# Altium schematic sheet Control circuit.SchDoc (part 2 of 4)
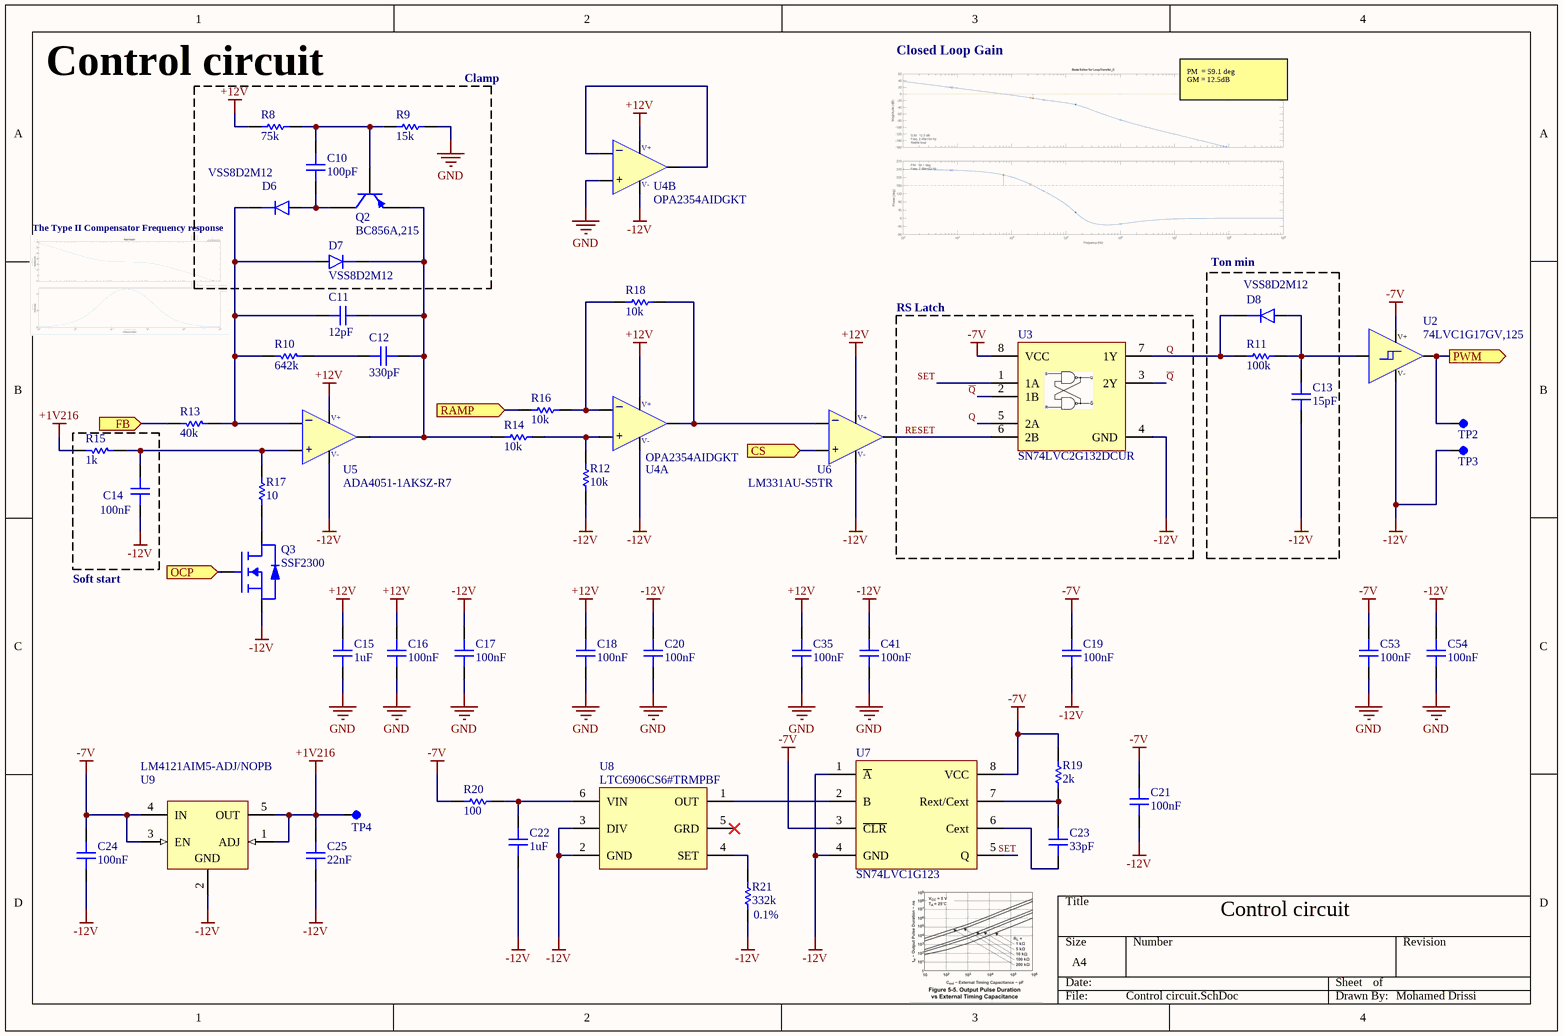
[diagram p1: Control circuit.SchDoc]
## Library data of the parts
C10 = Murata GCM1885C2A101JA16D: 100V 100pF C0G ±5% 0603 Multilayer Ceramic Capacitors MLCC - SMD/SMT ROHS; Manufacturer: Murata; Manufacturer Lifecycle Status: IN PRODUCTION; Temperature Coefficient: 30ppm/°C; Supplier: RS; Supplier Part Number: 8151323P; Manufacturer Part Number: GCM1885C2A101JA16D; RoHS: Compliant; Category: Ceramic Capacitors; Stock: 11200; Pricing: 1000=0,018, 2000=0,017, 5000=0,016, 10000=0,014 (EUR); Case/Package: 0603; Case Code (Imperial): 0603; Case Code (Metric): 1608; Depth: 800µm; Dielectric: C0G; Dielectric Material: Ceramic; Height: 800µm; Lead Free: Lead Free; Length: 1.6mm; Lifecycle Status: Production; Material: Ceramic; Max Operating Temperature: 125°C; Min Operating Temperature: -55°C; Mounting Technology: Surface Mount; Number of Terminals: 2; Radiation Hardening: No; Ratings: AEC-Q200; REACH SVHC: Yes; Schedule B: 8532240020, 8532240020|8532240020, 8532240020|8532240020|8532240020, 8532240020|8532240020|8532240020|8532240020; Termination: SMD/SMT; Tolerance: 5%; Voltage: 100V; Voltage Rating: 100V; Voltage Rating (DC): 100V; Width: 800µm; ComponentLink1URL: https://datasheet.octopart.com:443/GCM1885C2A101JA16D-Murata-datasheet-149522598.pdf?src-supplier=Farnell; ComponentLink1Description: https://datasheet.octopart.com:443/GCM1885C2A101JA16D-Murata-datasheet-149522598.pdf?src-supplier=Farnell; ComponentLink2URL: https://datasheet.octopart.com:443/GCM1885C2A101JA16D-Murata-datasheet-104277829.pdf?src-supplier=Newark; ComponentLink2Description: https://datasheet.octopart.com:443/GCM1885C2A101JA16D-Murata-datasheet-104277829.pdf?src-supplier=Newark; ComponentLink3URL: https://datasheet.octopart.com:443/GCM1885C2A101JA16D-Murata-datasheet-141266551.pdf?src-supplier=Geoflip; ComponentLink3Description: https://datasheet.octopart.com:443/GCM1885C2A101JA16D-Murata-datasheet-141266551.pdf?src-supplier=Geoflip; ComponentLink4URL: https://datasheet.octopart.com:443/GCM1885C2A101JA16D-Murata-datasheet-14404397.pdf?src-supplier=Future+Electronics; ComponentLink4Description: https://datasheet.octopart.com:443/GCM1885C2A101JA16D-Murata-datasheet-14404397.pdf?src-supplier=Future+Electronics; ComponentLink5URL: https://datasheet.octopart.com:443/GCM1885C2A101JA16D-Murata-datasheet-12524712.pdf?src-supplier=Future+Electronics; ComponentLink5Description: https://datasheet.octopart.com:443/GCM1885C2A101JA16D-Murata-datasheet-12524712.pdf?src-supplier=Future+Electronics; ComponentLink6URL: https://datasheet.octopart.com:443/GCM1885C2A101JA16D-Murata-datasheet-44104441.pdf?src-supplier=Future+Electronics; ComponentLink6Description: https://datasheet.octopart.com:443/GCM1885C2A101JA16D-Murata-datasheet-44104441.pdf?src-supplier=Future+Electronics; ComponentLink7URL: https://datasheet.octopart.com:443/GCM1885C2A101JA16D-Murata-datasheet-140657395.pdf?src-supplier=Ciiva; ComponentLink7Description: https://datasheet.octopart.com:443/GCM1885C2A101JA16D-Murata-datasheet-140657395.pdf?src-supplier=Ciiva; ComponentLink8URL: https://datasheet.octopart.com:443/GCM1885C2A101JA16D-Murata-datasheet-138717052.pdf?src-supplier=Ciiva; ComponentLink8Description: https://datasheet.octopart.com:443/GCM1885C2A101JA16D-Murata-datasheet-138717052.pdf?src-supplier=Ciiva; ComponentLink9URL: https://datasheet.octopart.com:443/GCM1885C2A101JA16D-Murata-datasheet-141971842.pdf?src-supplier=Arrow.cn; ComponentLink9Description: https://datasheet.octopart.com:443/GCM1885C2A101JA16D-Murata-datasheet-141971842.pdf?src-supplier=Arrow.cn; ComponentLink10URL: https://datasheet.octopart.com:443/GCM1885C2A101JA16D-Murata-datasheet-12511495.pdf?src-supplier=TME; ComponentLink10Description: https://datasheet.octopart.com:443/GCM1885C2A101JA16D-Murata-datasheet-12511495.pdf?src-supplier=TME; ComponentLink11URL: http://sigma.octopart.com:80/reach_statement/Murata-company-16.pdf?src-supplier=Compliance+Statements; ComponentLink11Description: http://sigma.octopart.com:80/reach_statement/Murata-company-16.pdf?src-supplier=Compliance+Statements
C11 = Vishay VJ0603A120KXJCW1BC: Ceramic Capacitor, Multilayer, Ceramic, 16V, 10% +Tol, 10% -Tol, C0G, 30ppm/Cel TC, 0.000012uF, Surface Mount, 0603; Manufacturer: Vishay; Supplier: DigiKey; Supplier Part Number: 720-VJ0603A120KXJCW1BCCT-ND; Manufacturer Part Number: VJ0603A120KXJCW1BC; RoHS: Compliant; Category: Ceramic Capacitors; Stock: 710; Pricing: 1=0,11, 10=0,059, 50=0,0408, 100=0,0353, 500=0,02592, 1000=0,02304 (USD); Case/Package: 0603; Case Code (Imperial): 0603; Case Code (Metric): 1608; China RoHS: Compliant; Depth: 800µm; Dielectric: C0G; Dielectric Material: Ceramic; Export Control Classification Number (ECCN) Code: EAR99; Height: 870µm; Harmonized Tariff Schedule (HTS) Code: 8532.24.00.20; Lead Free: Lead Free; Length: 1.6mm; Lifecycle Status: Production; Max Operating Temperature: 125°C; Min Operating Temperature: -55°C; Mounting Technology: Surface Mount; Number of Terminals: 2; REACH SVHC: Yes; Termination: SMD/SMT; Tolerance: 10%; Voltage Rating (DC): 16V; Weight: 2.012816mg; Width: 800µm; ComponentLink1URL: https://datasheet.octopart.com:443/VJ0603A120KXJCW1BC-Vishay-datasheet-182138897.pdf?src-supplier=IHS; ComponentLink1Description: https://datasheet.octopart.com:443/VJ0603A120KXJCW1BC-Vishay-datasheet-182138897.pdf?src-supplier=IHS; ComponentLink2URL: https://datasheet.octopart.com:443/VJ0603A120KXJCW1BC-Vishay-datasheet-182137606.pdf?src-supplier=IHS; ComponentLink2Description: https://datasheet.octopart.com:443/VJ0603A120KXJCW1BC-Vishay-datasheet-182137606.pdf?src-supplier=IHS; ComponentLink3URL: https://datasheet.octopart.com/VJ0603A120KXJCW1BC-Vishay-datasheet-13530908.pdf; ComponentLink3Description: https://datasheet.octopart.com/VJ0603A120KXJCW1BC-Vishay-datasheet-13530908.pdf; ComponentLink4URL: https://datasheet.octopart.com/VJ0603A120KXJCW1BC-Vishay-datasheet-13436109.pdf; ComponentLink4Description: https://datasheet.octopart.com/VJ0603A120KXJCW1BC-Vishay-datasheet-13436109.pdf; ComponentLink5URL: https://datasheet.octopart.com/VJ0603A120KXJCW1BC-Vishay-datasheet-13168783.pdf; ComponentLink5Description: https://datasheet.octopart.com/VJ0603A120KXJCW1BC-Vishay-datasheet-13168783.pdf; ComponentLink6URL: https://datasheet.octopart.com/VJ0603A120KXJCW1BC-Vishay-datasheet-13134009.pdf; ComponentLink6Description: https://datasheet.octopart.com/VJ0603A120KXJCW1BC-Vishay-datasheet-13134009.pdf; ComponentLink7URL: https://datasheet.octopart.com/VJ0603A120KXJCW1BC-Vishay-datasheet-13055807.pdf; ComponentLink7Description: https://datasheet.octopart.com/VJ0603A120KXJCW1BC-Vishay-datasheet-13055807.pdf; ComponentLink8URL: https://datasheet.octopart.com/VJ0603A120KXJCW1BC-Vishay-datasheet-13029350.pdf; ComponentLink8Description: https://datasheet.octopart.com/VJ0603A120KXJCW1BC-Vishay-datasheet-13029350.pdf; ComponentLink9URL: https://datasheet.octopart.com/VJ0603A120KXJCW1BC-Vishay-datasheet-12584848.pdf; ComponentLink9Description: https://datasheet.octopart.com/VJ0603A120KXJCW1BC-Vishay-datasheet-12584848.pdf; ComponentLink10URL: https://datasheet.octopart.com/VJ0603A120KXJCW1BC-Vishay-datasheet-12543093.pdf; ComponentLink10Description: https://datasheet.octopart.com/VJ0603A120KXJCW1BC-Vishay-datasheet-12543093.pdf; ComponentLink11URL: https://datasheet.octopart.com/VJ0603A120KXJCW1BC-Vishay-datasheet-12532924.pdf; ComponentLink11Description: https://datasheet.octopart.com/VJ0603A120KXJCW1BC-Vishay-datasheet-12532924.pdf; ComponentLink12URL: https://datasheet.octopart.com/VJ0603A120KXJCW1BC-Vishay-datasheet-12519409.pdf; ComponentLink12Description: https://datasheet.octopart.com/VJ0603A120KXJCW1BC-Vishay-datasheet-12519409.pdf; ComponentLink13URL: https://datasheet.octopart.com/VJ0603A120KXJCW1BC-Vishay-datasheet-12509873.pdf; ComponentLink13Description: https://datasheet.octopart.com/VJ0603A120KXJCW1BC-Vishay-datasheet-12509873.pdf; ComponentLink14URL: https://datasheet.octopart.com/VJ....W1BC-Basic-Commodity-Series-Vishay-datasheet-family-113.pdf; ComponentLink14Description: https://datasheet.octopart.com/VJ....W1BC-Basic-Commodity-Series-Vishay-datasheet-family-113.pdf; ComponentLink15URL: http://sigma.octopart.com:80/rohs_statement/VJ....W1BC-Basic-Commodity-Series-Vishay-family-122.pdf?src-supplier=Compliance+Statements; ComponentLink15Description: http://sigma.octopart.com:80/rohs_statement/VJ....W1BC-Basic-Commodity-Series-Vishay-family-122.pdf?src-supplier=Compliance+Statements
C12 = Wurth 885012006026: WCAP-CSGP 0603 (1608Metric) Ceramic Capacitor 0.063Lx0.031W 1.60mmx0.80mm C0G NP0 ±5% 330pF; Manufacturer: Wurth Elektronik; Manufacturer Lifecycle Status: ACTIVE; Insulation Resistance: 10GΩ; Voltage Rating: 16V; YEOL: 1 = Estimated lifetime > 10 years; Supplier: RS; Supplier Part Number: 2633921; Manufacturer Part Number: 885012006026; RoHS: Compliant; Category: Ceramic Capacitors; Stock: 3700; Pricing: 100=0,047, 500=0,043, 1000=0,038, 2000=0,034 (EUR); Case/Package: 0603; Case Code (Imperial): 0603; Case Code (Metric): 1608; Height: 800µm; Length: 1.6mm; Lifecycle Status: Production; Max Operating Temperature: 125°C; Min Operating Temperature: -55°C; Mounting Technology: Surface Mount; Thickness: 863.6µm; Tolerance: 5%; Voltage Rating (DC): 16V; Width: 800µm; ComponentLink1URL: https://datasheet.octopart.com:443/885012006026-Wurth-Elektronik-datasheet-168509597.pdf?src-supplier=Newark; ComponentLink1Description: https://datasheet.octopart.com:443/885012006026-Wurth-Elektronik-datasheet-168509597.pdf?src-supplier=Newark; ComponentLink2URL: https://datasheet.octopart.com:443/885012006026-W%C3%BCrth-Elektronik-datasheet-101615373.pdf?src-supplier=Wurth+Elektronik; ComponentLink2Description: https://datasheet.octopart.com:443/885012006026-W%C3%BCrth-Elektronik-datasheet-101615373.pdf?src-supplier=Wurth+Elektronik
C13 = Samsung CL10C150JC81PNC: 100V 15pF C0G 卤5% 0603 Multilayer Ceramic Capacitors MLCC - SMD/SMT ROHS; Manufacturer: Samsung Electro-Mechanics; Temperature Coefficient: 30ppm/°C; Tolerance: 5%; Supplier: DigiKey; Supplier Part Number: 1276-CL10C150JC81PNCDKR-ND; Manufacturer Part Number: CL10C150JC81PNC; RoHS: Compliant; Category: Ceramic Capacitors; Stock: 73765; Pricing: 1=0,1, 10=0,05, 50=0,0342, 100=0,0295, 500=0,02142, 1000=0,01896 (USD); Case/Package: 0603; China RoHS: Compliant; Country of Origin: Mainland China, Philippines, South Korea; Dielectric Material: Ceramic; Export Control Classification Number (ECCN) Code: EAR99; Height: 800µm; Harmonized Tariff Schedule (HTS) Code: 8532.24.00.20; Introduction Date: 2010-02-10; Length: 1.6mm; Lifecycle Status: Production; Material: Ceramic; Max Operating Temperature: 125°C; Min Operating Temperature: -55°C; Mounting Technology: Surface Mount; Number of Terminals: 2; REACH SVHC: Yes; Voltage Rating: 100V; Voltage Rating (DC): 100V; Width: 800µm; ComponentLink1URL: https://datasheet.octopart.com:443/CL10C150JC81PNC-Samsung-Electro-Mechanics-datasheet-176142735.pdf?src-supplier=IHS; ComponentLink1Description: https://datasheet.octopart.com:443/CL10C150JC81PNC-Samsung-Electro-Mechanics-datasheet-176142735.pdf?src-supplier=IHS
C14 C16-C21 C24 C35 C41 C53 C54 = Cal-chip GMC10X7R104K100NT: 100V 100nF X7R ±10% 0603 Multilayer Ceramic Capacitors MLCC - SMD/SMT ROHS; Manufacturer: Cal-Chip Electronics; Supplier: DigiKey; Supplier Part Number: 4713-GMC10X7R104K100NTCT-ND; Manufacturer Part Number: GMC10X7R104K100NT; RoHS: Compliant; Category: Ceramic Capacitors; Stock: 34767; Pricing: 1=0,1, 10=0,045, 50=0,0306, 100=0,0262, 500=0,01902, 1000=0,0168 (USD); Case/Package: 0603; China RoHS: Compliant; Dielectric Material: Ceramic; Height: 950µm; Length: 1.6mm; Lifecycle Status: Production; Max Operating Temperature: 125°C; Min Operating Temperature: -55°C; Mounting Technology: Surface Mount; Number of Terminals: 2; REACH SVHC: Yes; Voltage Rating (DC): 100V; Width: 800µm; ComponentLink1URL: https://datasheet.octopart.com:443/GMC10X7R104K100NT-Cal-Chip-Electronics-datasheet-182028815.pdf?src-supplier=IHS; ComponentLink1Description: https://datasheet.octopart.com:443/GMC10X7R104K100NT-Cal-Chip-Electronics-datasheet-182028815.pdf?src-supplier=IHS
C15 = Wurth 885382208005: WCAP-CSST 1206 (3216Metric) ceramic capacitor 0.126Lx0.063W 3.20mmx1.60mm X7R ±10% 1muF; Manufacturer: Wurth Elektronik; Manufacturer Lifecycle Status: ACTIVE; Insulation Resistance: 500MΩ; Voltage Rating: 50V; YEOL: 1 = Estimated lifetime > 10 years; Supplier: RS; Supplier Part Number: 1855579; Manufacturer Part Number: 885382208005; RoHS: Compliant; Category: Ceramic Capacitors; Stock: 1375; Pricing: 25=0,187, 250=0,174, 625=0,158, 1250=0,139, 2500=0,118 (EUR); Case/Package: 1206; Dielectric: X7R; Height: 1.6mm; Length: 3.2mm; Lifecycle Status: Production; Max Operating Temperature: 125°C; Min Operating Temperature: -55°C; Voltage Rating (DC): 50V; Width: 1.6mm; ComponentLink1URL: https://datasheet.octopart.com:443/885382208005-W%C3%BCrth-Elektronik-datasheet-137006684.pdf?src-supplier=Wurth+Elektronik; ComponentLink1Description: https://datasheet.octopart.com:443/885382208005-W%C3%BCrth-Elektronik-datasheet-137006684.pdf?src-supplier=Wurth+Elektronik
C22 = Samsung CL10B105KA8NNNC: 25V 1uF X7R 卤10% 0603 Multilayer Ceramic Capacitors MLCC - SMD/SMT ROHS; Manufacturer: Samsung Electro-Mechanics; Tolerance: 10%; Supplier: RS; Supplier Part Number: 7664847; Manufacturer Part Number: CL10B105KA8NNNC; RoHS: Compliant; Category: Ceramic Capacitors; Stock: 464000; Pricing: 4000=0,014, 8000=0,014, 16000=0,013, 24000=0,011, 40000=0,009 (EUR); Case/Package: 0603; Case Code (Imperial): 0603; Case Code (Metric): 1608; China RoHS: Compliant; Contact Plating: Tin; Country of Origin: Mainland China, Philippines, South Korea; Depth: 800µm; Dielectric: X7R; Dielectric Material: Ceramic; Export Control Classification Number (ECCN) Code: EAR99; Height: 900µm; Harmonized Tariff Schedule (HTS) Code: 8532.24.00.20; Introduction Date: 2009-11-02; Length: 1.6mm; Lifecycle Status: Production; Material: Ceramic; Max Operating Temperature: 125°C; Min Operating Temperature: -55°C; Mounting Technology: Surface Mount; Number of Terminals: 2; Radiation Hardening: No; REACH SVHC: Yes; Schedule B: 8532240020, 8532240020|8532240020, 8532240020|8532240020|8532240020, 8532240020|8532240020|8532240020|8532240020; Thickness: 889µm; Voltage: 25V; Voltage Rating: 25V; Voltage Rating (DC): 25V; Width: 800µm; ComponentLink1URL: https://datasheet.octopart.com:443/CL10B105KA8NNNC-Samsung-Electro-Mechanics-datasheet-182019882.pdf?src-supplier=IHS; ComponentLink1Description: https://datasheet.octopart.com:443/CL10B105KA8NNNC-Samsung-Electro-Mechanics-datasheet-182019882.pdf?src-supplier=IHS; ComponentLink2URL: https://datasheet.octopart.com:443/CL10B105KA8NNNC-Samsung-Electro-Mechanics-datasheet-106547815.pdf?src-supplier=Upverter; ComponentLink2Description: https://datasheet.octopart.com:443/CL10B105KA8NNNC-Samsung-Electro-Mechanics-datasheet-106547815.pdf?src-supplier=Upverter; ComponentLink3URL: https://datasheet.octopart.com:443/CL10B105KA8NNNC-Samsung-Electro-Mechanics-datasheet-137699931.pdf?src-supplier=Samsung+SCT; ComponentLink3Description: https://datasheet.octopart.com:443/CL10B105KA8NNNC-Samsung-Electro-Mechanics-datasheet-137699931.pdf?src-supplier=Samsung+SCT; ComponentLink4URL: https://datasheet.octopart.com:443/CL10B105KA8NNNC-Samsung-Electro-Mechanics-datasheet-116890983.pdf?src-supplier=Future+Electronics; ComponentLink4Description: https://datasheet.octopart.com:443/CL10B105KA8NNNC-Samsung-Electro-Mechanics-datasheet-116890983.pdf?src-supplier=Future+Electronics; ComponentLink5URL: https://datasheet.octopart.com:443/CL10B105KA8NNNC-Samsung-datasheet-12527851.pdf?src-supplier=Future+Electronics; ComponentLink5Description: https://datasheet.octopart.com:443/CL10B105KA8NNNC-Samsung-datasheet-12527851.pdf?src-supplier=Future+Electronics; ComponentLink6URL: https://datasheet.octopart.com:443/CL10B105KA8NNNC-Samsung-datasheet-26669022.pdf?src-supplier=Future+Electronics; ComponentLink6Description: https://datasheet.octopart.com:443/CL10B105KA8NNNC-Samsung-datasheet-26669022.pdf?src-supplier=Future+Electronics; ComponentLink7URL: https://datasheet.octopart.com:443/CL10B105KA8NNNC-Samsung-Electro-Mechanics-datasheet-149136795.pdf?src-supplier=Future+Electronics; ComponentLink7Description: https://datasheet.octopart.com:443/CL10B105KA8NNNC-Samsung-Electro-Mechanics-datasheet-149136795.pdf?src-supplier=Future+Electronics; ComponentLink8URL: https://datasheet.octopart.com:443/CL10B105KA8NNNC-Samsung-datasheet-37081328.pdf?src-supplier=Future+Electronics; ComponentLink8Description: https://datasheet.octopart.com:443/CL10B105KA8NNNC-Samsung-datasheet-37081328.pdf?src-supplier=Future+Electronics; ComponentLink9URL: https://datasheet.octopart.com/CL10B105KA8NNNC-Samsung-Electro-Mechanics-datasheet-97040617.pdf; ComponentLink9Description: https://datasheet.octopart.com/CL10B105KA8NNNC-Samsung-Electro-Mechanics-datasheet-97040617.pdf; ComponentLink10URL: https://datasheet.octopart.com/CL10B105KA8NNNC-Samsung-Electro-Mechanics-datasheet-8324245.pdf; ComponentLink10Description: https://datasheet.octopart.com/CL10B105KA8NNNC-Samsung-Electro-Mechanics-datasheet-8324245.pdf; ComponentLink11URL: https://datasheet.octopart.com:443/CL10B105KA8NNNC-Samsung-datasheet-59220082.pdf?src-supplier=TME; ComponentLink11Description: https://datasheet.octopart.com:443/CL10B105KA8NNNC-Samsung-datasheet-59220082.pdf?src-supplier=TME; ComponentLink12URL: https://datasheet.octopart.com:443/CL10B105KA8NNNC-Samsung-Electro-Mechanics-datasheet-11897796.pdf?src-supplier=Arrow+Electronics; ComponentLink12Description: https://datasheet.octopart.com:443/CL10B105KA8NNNC-Samsung-Electro-Mechanics-datasheet-11897796.pdf?src-supplier=Arrow+Electronics
C23 = Samsung CL10C330JB8NNNC: Multilayer Ceramic Capacitor, 33 pF, 50 V, ± 5%, C0G (NP0), 0603 [1608 Metric]; Manufacturer: Samsung Electro-Mechanics; Temperature Coefficient: 30ppm/°C; Voltage: 50V; Supplier: RS; Supplier Part Number: 7665070; Manufacturer Part Number: CL10C330JB8NNNC; RoHS: Compliant; Category: Ceramic Capacitors; Stock: 292000; Pricing: 4000=0,009, 12000=0,008, 20000=0,008, 40000=0,007, 100000=0,007 (EUR); Case/Package: 0603; Case Code (Imperial): 0603; Case Code (Metric): 1608; China RoHS: Compliant; Contact Plating: Tin; Country of Origin: Mainland China, Philippines, South Korea; Depth: 800µm; Dielectric: C0G; Dielectric Material: Ceramic; Export Control Classification Number (ECCN) Code: EAR99; Height: 900µm; Harmonized Tariff Schedule (HTS) Code: 8532.24.00.20; Introduction Date: 2010-02-10; Lead Free: Lead Free; Length: 1.6mm; Lifecycle Status: Production; Material: Ceramic; Max Operating Temperature: 125°C; Min Operating Temperature: -55°C; Mounting Technology: Surface Mount; Number of Terminals: 2; Radiation Hardening: No; REACH SVHC: Yes; Schedule B: 8532240020, 8532240020|8532240020|8532240020|8532240020|8532240020; Thickness: 889µm; Tolerance: 5%; Voltage Rating: 50V; Voltage Rating (DC): 50V; Width: 800µm; ComponentLink1URL: https://datasheet.octopart.com:443/CL10C330JB8NNNC-Samsung-Electro-Mechanics-datasheet-136482426.pdf?src-supplier=IHS; ComponentLink1Description: https://datasheet.octopart.com:443/CL10C330JB8NNNC-Samsung-Electro-Mechanics-datasheet-136482426.pdf?src-supplier=IHS; ComponentLink2URL: https://datasheet.octopart.com/CL10C330JB8NNNC-Samsung-Electro-Mechanics-datasheet-8324245.pdf; ComponentLink2Description: https://datasheet.octopart.com/CL10C330JB8NNNC-Samsung-Electro-Mechanics-datasheet-8324245.pdf; ComponentLink3URL: https://datasheet.octopart.com/CL10C330JB8NNNC-Samsung-Electro-Mechanics-datasheet-97040617.pdf; ComponentLink3Description: https://datasheet.octopart.com/CL10C330JB8NNNC-Samsung-Electro-Mechanics-datasheet-97040617.pdf; ComponentLink4URL: https://datasheet.octopart.com/General-Multilayer-Ceramic-Capacitors-Samsung-datasheet-family-111.pdf; ComponentLink4Description: https://datasheet.octopart.com/General-Multilayer-Ceramic-Capacitors-Samsung-datasheet-family-111.pdf; ComponentLink5URL: https://datasheet.octopart.com:443/CL10C330JB8NNNC-Samsung-Electro-Mechanics-datasheet-110226363.pdf?src-supplier=Future+Electronics; ComponentLink5Description: https://datasheet.octopart.com:443/CL10C330JB8NNNC-Samsung-Electro-Mechanics-datasheet-110226363.pdf?src-supplier=Future+Electronics; ComponentLink6URL: https://datasheet.octopart.com:443/CL10C330JB8NNNC-Samsung-Electro-Mechanics-datasheet-81462031.pdf?src-supplier=Future+Electronics; ComponentLink6Description: https://datasheet.octopart.com:443/CL10C330JB8NNNC-Samsung-Electro-Mechanics-datasheet-81462031.pdf?src-supplier=Future+Electronics; ComponentLink7URL: https://datasheet.octopart.com:443/CL10C330JB8NNNC-Samsung-datasheet-42280639.pdf?src-supplier=Future+Electronics; ComponentLink7Description: https://datasheet.octopart.com:443/CL10C330JB8NNNC-Samsung-datasheet-42280639.pdf?src-supplier=Future+Electronics; ComponentLink8URL: https://datasheet.octopart.com:443/CL10C330JB8NNNC-Samsung-datasheet-26669168.pdf?src-supplier=Future+Electronics; ComponentLink8Description: https://datasheet.octopart.com:443/CL10C330JB8NNNC-Samsung-datasheet-26669168.pdf?src-supplier=Future+Electronics; ComponentLink9URL: https://datasheet.octopart.com:443/CL10C330JB8NNNC-Samsung-Electro-Mechanics-datasheet-149136915.pdf?src-supplier=Future+Electronics; ComponentLink9Description: https://datasheet.octopart.com:443/CL10C330JB8NNNC-Samsung-Electro-Mechanics-datasheet-149136915.pdf?src-supplier=Future+Electronics; ComponentLink10URL: https://datasheet.octopart.com:443/CL10C330JB8NNNC-Samsung-datasheet-8326407.pdf?src-supplier=TME; ComponentLink10Description: https://datasheet.octopart.com:443/CL10C330JB8NNNC-Samsung-datasheet-8326407.pdf?src-supplier=TME; ComponentLink11URL: http://sigma.octopart.com:80/rohs_certificate/General-Multilayer-Ceramic-Capacitors-Samsung-family-110.pdf?src-supplier=Compliance+Statements; ComponentLink11Description: http://sigma.octopart.com:80/rohs_certificate/General-Multilayer-Ceramic-Capacitors-Samsung-family-110.pdf?src-supplier=Compliance+Statements; ComponentLink12URL: http://sigma.octopart.com:80/rohs_statement/General-Multilayer-Ceramic-Capacitors-Samsung-family-132.pdf?src-supplier=Compliance+Statements; ComponentLink12Description: http://sigma.octopart.com:80/rohs_statement/General-Multilayer-Ceramic-Capacitors-Samsung-family-132.pdf?src-supplier=Compliance+Statements; ComponentLink13URL: http://sigma.octopart.com:80/reach_statement/General-Multilayer-Ceramic-Capacitors-Samsung-family-133.pdf?src-supplier=Compliance+Statements; ComponentLink13Description: http://sigma.octopart.com:80/reach_statement/General-Multilayer-Ceramic-Capacitors-Samsung-family-133.pdf?src-supplier=Compliance+Statements
C25 = Yageo C0603C223K4RACTU: Multilayer Ceramic Capacitors MLCC – SMD/SMT; KEMET; C0603C223K4RACTU; 22 nF; 0603; 16 V; 16 V; Manufacturer: Yageo Group; Dielectric: X7R; Temperature Coefficient: 30ppm/°C; Tolerance: 10%; Voltage Rating: 16V; Supplier: RS; Supplier Part Number: 2053279; Manufacturer Part Number: C0603C223K4RACTU; RoHS: Compliant; Category: Ceramic Capacitors; Stock: 3250; Pricing: 250=0,015, 1000=0,011, 2000=0,010 (EUR); Case/Package: 0603; Case Code (Imperial): 0603; China RoHS: Compliant; Country of Origin: Mexico; Depth: 800µm; Dielectric Material: Ceramic; Export Control Classification Number (ECCN) Code: EAR99; Height: 800µm; Harmonized Tariff Schedule (HTS) Code: 8532.24.00.20; Introduction Date: 2001-04-27; Lead Free: Lead Free; Length: 1.6mm; Lifecycle Status: Production; Material: Ceramic; Max Operating Temperature: 125°C; Min Operating Temperature: -55°C; Mounting Technology: Surface Mount; Pins: 2; Number of Terminals: 2; Radiation Hardening: No; REACH SVHC: Yes; Schedule B: 8532240020, 8532240020|8532240020|8532240020|8532240020|8532240020|8532240020|8532240020|8532240020|8532240020|8532240020|8532240020|8532240020|8532240020|8532240020|8532240020|8532240020|8532240020|8532240020|8532240020|8532240020|8532240020|8532240020|8532240020|85; Termination: SMD/SMT; Thickness: 863.6µm; Voltage Rating (DC): 16V; Weight: 2.012816mg; Width: 800µm; ComponentLink1URL: https://datasheet.octopart.com:443/C0603C223K4RACTU-KEMET-datasheet-178445679.pdf?src-supplier=IHS; ComponentLink1Description: https://datasheet.octopart.com:443/C0603C223K4RACTU-KEMET-datasheet-178445679.pdf?src-supplier=IHS; ComponentLink2URL: https://datasheet.octopart.com:443/C0603C223K4RAC7867-KEMET-datasheet-184792863.pdf?src-supplier=IHS; ComponentLink2Description: https://datasheet.octopart.com:443/C0603C223K4RAC7867-KEMET-datasheet-184792863.pdf?src-supplier=IHS; ComponentLink3URL: https://datasheet.octopart.com:443/C0603C223K4RACTU-KEMET-datasheet-137357759.pdf?src-supplier=Farnell; ComponentLink3Description: https://datasheet.octopart.com:443/C0603C223K4RACTU-KEMET-datasheet-137357759.pdf?src-supplier=Farnell; ComponentLink4URL: https://datasheet.octopart.com:443/C0603C223K4RACTU-Kemet-datasheet-12608295.pdf?src-supplier=Farnell; ComponentLink4Description: https://datasheet.octopart.com:443/C0603C223K4RACTU-Kemet-datasheet-12608295.pdf?src-supplier=Farnell; ComponentLink5URL: https://datasheet.octopart.com:443/C0603C223K4RACTU-Kemet-datasheet-11992184.pdf?src-supplier=Farnell; ComponentLink5Description: https://datasheet.octopart.com:443/C0603C223K4RACTU-Kemet-datasheet-11992184.pdf?src-supplier=Farnell; ComponentLink6URL: https://datasheet.octopart.com:443/C0603C223K4RACTU-Kemet-datasheet-10942409.pdf?src-supplier=Farnell; ComponentLink6Description: https://datasheet.octopart.com:443/C0603C223K4RACTU-Kemet-datasheet-10942409.pdf?src-supplier=Farnell; ComponentLink7URL: https://datasheet.octopart.com:443/C0603C223K4RACTU-Kemet-datasheet-10404442.pdf?src-supplier=Farnell; ComponentLink7Description: https://datasheet.octopart.com:443/C0603C223K4RACTU-Kemet-datasheet-10404442.pdf?src-supplier=Farnell; ComponentLink8URL: https://datasheet.octopart.com:443/C0603C223K4RACTU-KEMET-datasheet-101575748.pdf?src-supplier=Farnell; ComponentLink8Description: https://datasheet.octopart.com:443/C0603C223K4RACTU-KEMET-datasheet-101575748.pdf?src-supplier=Farnell; ComponentLink9URL: https://datasheet.octopart.com:443/C0603C223K4RACTU-Kemet-datasheet-41232427.pdf?src-supplier=Farnell; ComponentLink9Description: https://datasheet.octopart.com:443/C0603C223K4RACTU-Kemet-datasheet-41232427.pdf?src-supplier=Farnell; ComponentLink10URL: https://datasheet.octopart.com:443/C0603C223K4RACTU-KEMET-datasheet-137357764.pdf?src-supplier=Upverter; ComponentLink10Description: https://datasheet.octopart.com:443/C0603C223K4RACTU-KEMET-datasheet-137357764.pdf?src-supplier=Upverter; ComponentLink11URL: https://datasheet.octopart.com:443/C0603C223K4RACTU-KEMET-datasheet-157246124.pdf?src-supplier=Electro+Sonic; ComponentLink11Description: https://datasheet.octopart.com:443/C0603C223K4RACTU-KEMET-datasheet-157246124.pdf?src-supplier=Electro+Sonic; ComponentLink12URL: https://datasheet.octopart.com:443/C0603C223K4RACTU-KEMET-datasheet-32036385.pdf?src-supplier=Electro+Sonic; ComponentLink12Description: https://datasheet.octopart.com:443/C0603C223K4RACTU-KEMET-datasheet-32036385.pdf?src-supplier=Electro+Sonic; ComponentLink13URL: https://datasheet.octopart.com:443/C0603C223K4RACTU-Kemet-datasheet-65850041.pdf?src-supplier=element14+APAC; ComponentLink13Description: https://datasheet.octopart.com:443/C0603C223K4RACTU-Kemet-datasheet-65850041.pdf?src-supplier=element14+APAC; ComponentLink14URL: https://datasheet.octopart.com:443/C0603C223K4RACTU-Kemet-datasheet-66413429.pdf?src-supplier=element14+APAC; ComponentLink14Description: https://datasheet.octopart.com:443/C0603C223K4RACTU-Kemet-datasheet-66413429.pdf?src-supplier=element14+APAC; ComponentLink15URL: https://datasheet.octopart.com:443/C0603C223K4RACTU-KEMET-datasheet-130259424.pdf?src-supplier=TME; ComponentLink15Description: https://datasheet.octopart.com:443/C0603C223K4RACTU-KEMET-datasheet-130259424.pdf?src-supplier=TME; ComponentLink16URL: https://datasheet.octopart.com:443/C0603C223K4RACTU-KEMET-datasheet-130256537.pdf?src-supplier=TME; ComponentLink16Description: https://datasheet.octopart.com:443/C0603C223K4RACTU-KEMET-datasheet-130256537.pdf?src-supplier=TME; ComponentLink17URL: https://datasheet.octopart.com:443/C0603C223K4RACTU-KEMET-datasheet-110724412.pdf?src-supplier=RS+(Formerly+Allied+Electronics); ComponentLink17Description: https://datasheet.octopart.com:443/C0603C223K4RACTU-KEMET-datasheet-110724412.pdf?src-supplier=RS+(Formerly+Allied+Electronics); ComponentLink18URL: https://datasheet.octopart.com:443/C0603C223K4RACTU-Kemet-datasheet-464.pdf?src-supplier=RS+(Formerly+Allied+Electronics); ComponentLink18Description: https://datasheet.octopart.com:443/C0603C223K4RACTU-Kemet-datasheet-464.pdf?src-supplier=RS+(Formerly+Allied+Electronics); ComponentLink19URL: https://datasheet.octopart.com/C0603C223K4RACTU-KEMET-datasheet-84169754.pdf; ComponentLink19Description: https://datasheet.octopart.com/C0603C223K4RACTU-KEMET-datasheet-84169754.pdf; ComponentLink20URL: https://datasheet.octopart.com:443/C0603C223K4RACTU-Kemet-datasheet-27203261.pdf?src-supplier=Newark; ComponentLink20Description: https://datasheet.octopart.com:443/C0603C223K4RACTU-Kemet-datasheet-27203261.pdf?src-supplier=Newark; ComponentLink21URL: https://datasheet.octopart.com:443/C0603C223K4RACTU-Kemet-datasheet-5313890.pdf?src-supplier=element14; ComponentLink21Description: https://datasheet.octopart.com:443/C0603C223K4RACTU-Kemet-datasheet-5313890.pdf?src-supplier=element14; ComponentLink22URL: https://datasheet.octopart.com:443/C0603C223K4RAC-TU-Kemet-datasheet-7828143.pdf?src-supplier=Jameco; ComponentLink22Description: https://datasheet.octopart.com:443/C0603C223K4RAC-TU-Kemet-datasheet-7828143.pdf?src-supplier=Jameco; ComponentLink23URL: http://sigma.octopart.com:80/rohs_statement/Yageo-company-2.pdf?src-supplier=Compliance+Statements; ComponentLink23Description: http://sigma.octopart.com:80/rohs_statement/Yageo-company-2.pdf?src-supplier=Compliance+Statements; ComponentLink24URL: http://sigma.octopart.com:80/conflict_mineral_statement/Yageo-company-3.pdf?src-supplier=Compliance+Statements; ComponentLink24Description: http://sigma.octopart.com:80/conflict_mineral_statement/Yageo-company-3.pdf?src-supplier=Compliance+Statements
D6-D8 = Vishay VSS8D2M12-M3/H: Rectifier Diode, Schottky, 1 Phase, 1 Element, 2A, 120V V(RRM), Silicon, DO-221AD; Manufacturer: Vishay; Forward Voltage: 810mV; Max Forward Surge Current (Ifsm): 50A; Number of Elements: 1; Peak Reverse Current: 250µA; Supplier: RS; Supplier Part Number: 2190367; Manufacturer Part Number: VSS8D2M12-M3/H; RoHS: Compliant; Category: Rectifier Diodes; Stock: 13750; Pricing: 50=0,204 (EUR); Lifecycle Status: Production; Max Operating Temperature: 175°C; Max Output current: 2A; Min Operating Temperature: -40°C; Number of Terminals: 2; Reverse Standoff Voltage: 120V; ComponentLink1URL: https://datasheet.octopart.com:443/VSS8D2M12-M3-H-Vishay-datasheet-181480222.pdf?src-supplier=Newark; ComponentLink1Description: https://datasheet.octopart.com:443/VSS8D2M12-M3-H-Vishay-datasheet-181480222.pdf?src-supplier=Newark; ComponentLink2URL: http://sigma.octopart.com:80/rohs_statement/Vishay-company-15.pdf?src-supplier=Compliance+Statements; ComponentLink2Description: http://sigma.octopart.com:80/rohs_statement/Vishay-company-15.pdf?src-supplier=Compliance+Statements
Q2 = NXP BC856A,215: BC856 Series 65 V 100 mA SMT PNP General Purpose Transistor - SOT-23; Manufacturer: Nexperia; Manufacturer Lifecycle Status: RELEASED FOR SUPPLY; Collector Base Voltage (VCBO): -80V; Collector Emitter Breakdown Voltage: -65V; Collector Emitter Saturation Voltage: 650mV; Collector Emitter Voltage (VCEO): 65V; Element Configuration: Single; Emitter Base Voltage (VEBO): -5V; Frequency: 100MHz; hFE Min: 125; Max Collector Current: 100mA; Max Junction Temperature (Tj): 150°C; Max Power Dissipation: 300mW; Number of Elements: 1; Power Dissipation: 250mW; Supplier: Arrow Electronics; Supplier Part Number: BC856A,215; Manufacturer Part Number: BC856A,215; RoHS: Compliant; Category: BJTs; Stock: 1532; Pricing: 1=0,1021, 10=0,0654, 100=0,0398, 500=0,0286, 1000=0,025 (USD); Ambient Temperature Range High: 150°C; Case/Package: SOT-23; China RoHS: Compliant; Contact Plating: Tin; Country of Origin: Mainland China; Export Control Classification Number (ECCN) Code: EAR99; Gain Bandwidth Product: 100MHz; Height: 1.1mm; Harmonized Tariff Schedule (HTS) Code: 8541.21.00.95; Introduction Date: 1993-03-01; Lead Free: Lead Free; Length: 6.35mm; Lifecycle Status: Production; Max Breakdown Voltage: 65V; Max Operating Temperature: 150°C; Min Operating Temperature: -65°C; Mounting Technology: Surface Mount; Pins: 3; Number of Terminals: 3; Polarity: PNP; Radiation Hardening: No; REACH SVHC: Yes; Schedule B: 8541210080, 8541210080|8541210080, 8541210080|8541210080|8541210080, 8541210080|8541210080|8541210080|8541210080; Transition Frequency: 100MHz; Weight: 4.535924g; Width: 6.35mm; ComponentLink1URL: https://datasheet.octopart.com:443/BC856A%2C215-Nexperia-datasheet-180923436.pdf?src-supplier=IHS; ComponentLink1Description: https://datasheet.octopart.com:443/BC856A%2C215-Nexperia-datasheet-180923436.pdf?src-supplier=IHS; ComponentLink2URL: https://datasheet.octopart.com:443/BC856A%2C215-Nexperia-datasheet-8507722.pdf?src-supplier=Newark; ComponentLink2Description: https://datasheet.octopart.com:443/BC856A%2C215-Nexperia-datasheet-8507722.pdf?src-supplier=Newark; ComponentLink3URL: https://datasheet.octopart.com:443/BC856A%2C215-Nexperia-datasheet-87580908.pdf?src-supplier=Upverter; ComponentLink3Description: https://datasheet.octopart.com:443/BC856A%2C215-Nexperia-datasheet-87580908.pdf?src-supplier=Upverter; ComponentLink4URL: https://sigma.octopart.com:443/138797052/technical_drawing/Nexperia-BC856A%2C215.pdf?src-supplier=Upverter; ComponentLink4Description: https://sigma.octopart.com:443/138797052/technical_drawing/Nexperia-BC856A%2C215.pdf?src-supplier=Upverter; ComponentLink5URL: https://datasheet.octopart.com:443/BC856A%2C215-NXP-datasheet-56633.pdf?src-supplier=Future+Electronics; ComponentLink5Description: https://datasheet.octopart.com:443/BC856A%2C215-NXP-datasheet-56633.pdf?src-supplier=Future+Electronics; ComponentLink6URL: http://sigma.octopart.com:80/reach_statement/NXP-Semiconductors-company-13.pdf?src-supplier=Compliance+Statements; ComponentLink6Description: http://sigma.octopart.com:80/reach_statement/NXP-Semiconductors-company-13.pdf?src-supplier=Compliance+Statements; ComponentLink7URL: http://sigma.octopart.com:80/rohs_statement/NXP-Semiconductors-company-12.pdf?src-supplier=Compliance+Statements; ComponentLink7Description: http://sigma.octopart.com:80/rohs_statement/NXP-Semiconductors-company-12.pdf?src-supplier=Compliance+Statements
Q3 = Semiconductor SSF2300: Trans Mosfet N-ch 20V 4.5A 3-PIN SOT-23 T/r
R8 = Vishay CRCW060375K0FKEAC: 100mW Thick Film Resistors 75V ±100ppm/℃ ±1% 15kΩ 0603 Chip Resistor - Surface Mount ROHS; Manufacturer: Vishay; Temperature Coefficient: 100ppm/°C; Voltage Rating (DC): 50V; Supplier: DigiKey; Supplier Part Number: 541-5552-1-ND; Manufacturer Part Number: CRCW060375K0FKEAC; RoHS: Compliant; Category: Chip SMD Resistors; Stock: 204017; Pricing: 1=0,1, 10=0,031, 25=0,0228, 50=0,0186, 100=0,0152, 250=0,01188, 500=0,010, 1000=0,00851 (USD); Case/Package: 0603; China RoHS: Non-Compliant; Height: 450µm; Lead Free: Lead Free; Length: 1.6mm; Lifecycle Status: Production; Max Operating Temperature: 155°C; Min Operating Temperature: -55°C; Mounting Technology: Surface Mount; Number of Terminals: 2; Power Rating: 100mW; REACH SVHC: Yes; Schedule B: 8533210045, 8533210045|8533210045|8533210045|8533210045|8533210045; Tolerance: 1%; Width: 800µm; Working Voltage: 75V; ComponentLink1URL: https://datasheet.octopart.com:443/CRCW060375K0FKEAC-Vishay-datasheet-175423585.pdf?src-supplier=Newark; ComponentLink1Description: https://datasheet.octopart.com:443/CRCW060375K0FKEAC-Vishay-datasheet-175423585.pdf?src-supplier=Newark; ComponentLink2URL: https://datasheet.octopart.com:443/CRCW060375K0FKEAC-Vishay-datasheet-100063072.pdf?src-supplier=Future+Electronics; ComponentLink2Description: https://datasheet.octopart.com:443/CRCW060375K0FKEAC-Vishay-datasheet-100063072.pdf?src-supplier=Future+Electronics; ComponentLink3URL: https://datasheet.octopart.com:443/CRCW060375K0FKEAC-Vishay-datasheet-62316122.pdf?src-supplier=Future+Electronics; ComponentLink3Description: https://datasheet.octopart.com:443/CRCW060375K0FKEAC-Vishay-datasheet-62316122.pdf?src-supplier=Future+Electronics; ComponentLink4URL: http://sigma.octopart.com:80/rohs_statement/Vishay-company-15.pdf?src-supplier=Compliance+Statements; ComponentLink4Description: http://sigma.octopart.com:80/rohs_statement/Vishay-company-15.pdf?src-supplier=Compliance+Statements; Case Code (Imperial): 0603; Composition: Thick Film; Contact Plating: Tin; Country of Origin: Mainland China, Taiwan; Depth: 800µm; Export Control Classification Number (ECCN) Code: EAR99; Features: Moisture Resistant; Harmonized Tariff Schedule (HTS) Code: 8533.21.00.30; Introduction Date: 2004-10-04; Max Power Dissipation: 100mW; Military Standard: Not; Pins: 2; Number of Terminations: 2; Packaging: Tape & Reel; Radiation Hardening: No; Termination: SMD/SMT; Voltage Rating: 75V; ComponentLink5URL: https://datasheet.octopart.com:443/RC0603FR-0715KL-Yageo-datasheet-175887523.pdf?src-supplier=Newark; ComponentLink5Description: https://datasheet.octopart.com:443/RC0603FR-0715KL-Yageo-datasheet-175887523.pdf?src-supplier=Newark; ComponentLink6URL: https://datasheet.octopart.com:443/RC0603FR-0715KL-Yageo-datasheet-8328172.pdf?src-supplier=Newark; ComponentLink6Description: https://datasheet.octopart.com:443/RC0603FR-0715KL-Yageo-datasheet-8328172.pdf?src-supplier=Newark; ComponentLink7URL: https://datasheet.octopart.com:443/RC0603FR-0715KL-Yageo-datasheet-62067350.pdf?src-supplier=element14+APAC; ComponentLink7Description: https://datasheet.octopart.com:443/RC0603FR-0715KL-Yageo-datasheet-62067350.pdf?src-supplier=element14+APAC; ComponentLink8URL: https://datasheet.octopart.com:443/RC0603FR-0715KL-Yageo-datasheet-103092701.pdf?src-supplier=Upverter; ComponentLink8Description: https://datasheet.octopart.com:443/RC0603FR-0715KL-Yageo-datasheet-103092701.pdf?src-supplier=Upverter; ComponentLink9URL: https://datasheet.octopart.com:443/RC0603FR-0715KL-Yageo-datasheet-34211833.pdf?src-supplier=Farnell; ComponentLink9Description: https://datasheet.octopart.com:443/RC0603FR-0715KL-Yageo-datasheet-34211833.pdf?src-supplier=Farnell; ComponentLink10URL: https://datasheet.octopart.com:443/RC0603FR-0715KL-Yageo-Group-datasheet-176638170.pdf?src-supplier=Future+Electronics; ComponentLink10Description: https://datasheet.octopart.com:443/RC0603FR-0715KL-Yageo-Group-datasheet-176638170.pdf?src-supplier=Future+Electronics; ComponentLink11URL: https://datasheet.octopart.com:443/RC0603FR-0715KL-Yageo-datasheet-164759695.pdf?src-supplier=Future+Electronics; ComponentLink11Description: https://datasheet.octopart.com:443/RC0603FR-0715KL-Yageo-datasheet-164759695.pdf?src-supplier=Future+Electronics; ComponentLink12URL: https://datasheet.octopart.com:443/RC0603FR-0715KL-Yageo-datasheet-137700087.pdf?src-supplier=Future+Electronics; ComponentLink12Description: https://datasheet.octopart.com:443/RC0603FR-0715KL-Yageo-datasheet-137700087.pdf?src-supplier=Future+Electronics; ComponentLink13URL: https://datasheet.octopart.com:443/RC0603FR-0715KL-Yageo-datasheet-27584510.pdf?src-supplier=Future+Electronics; ComponentLink13Description: https://datasheet.octopart.com:443/RC0603FR-0715KL-Yageo-datasheet-27584510.pdf?src-supplier=Future+Electronics; ComponentLink14URL: https://datasheet.octopart.com:443/RC0603FR-0715KL-Yageo-datasheet-15599030.pdf?src-supplier=Future+Electronics; ComponentLink14Description: https://datasheet.octopart.com:443/RC0603FR-0715KL-Yageo-datasheet-15599030.pdf?src-supplier=Future+Electronics; ComponentLink15URL: https://datasheet.octopart.com:443/RC0603FR-0715KL-Yageo-datasheet-12596169.pdf?src-supplier=Future+Electronics; ComponentLink15Description: https://datasheet.octopart.com:443/RC0603FR-0715KL-Yageo-datasheet-12596169.pdf?src-supplier=Future+Electronics; ComponentLink16URL: https://datasheet.octopart.com:443/RC0603FR-0715KL-Yageo-datasheet-8324193.pdf?src-supplier=Future+Electronics; ComponentLink16Description: https://datasheet.octopart.com:443/RC0603FR-0715KL-Yageo-datasheet-8324193.pdf?src-supplier=Future+Electronics; ComponentLink17URL: https://datasheet.octopart.com/RC0603FR-0715KL-Yageo-datasheet-73766026.pdf; ComponentLink17Description: https://datasheet.octopart.com/RC0603FR-0715KL-Yageo-datasheet-73766026.pdf; ComponentLink18URL: https://datasheet.octopart.com:443/RC0603FR-0715KL-Yageo-datasheet-118562.pdf?src-supplier=DigiKey; ComponentLink18Description: https://datasheet.octopart.com:443/RC0603FR-0715KL-Yageo-datasheet-118562.pdf?src-supplier=DigiKey; ComponentLink19URL: http://sigma.octopart.com:80/conflict_mineral_statement/Yageo-company-3.pdf?src-supplier=Compliance+Statements; ComponentLink19Description: http://sigma.octopart.com:80/conflict_mineral_statement/Yageo-company-3.pdf?src-supplier=Compliance+Statements; ComponentLink20URL: http://sigma.octopart.com:80/rohs_statement/Yageo-company-2.pdf?src-supplier=Compliance+Statements; ComponentLink20Description: http://sigma.octopart.com:80/rohs_statement/Yageo-company-2.pdf?src-supplier=Compliance+Statements
R9 = Yageo RC0603FR-0715KL: 100mW Thick Film Resistors 75V ±100ppm/℃ ±1% 15kΩ 0603 Chip Resistor - Surface Mount ROHS
R10 = TOA RN73H1JTTD6423B50: Fixed Resistor, Thin Film, 0.1W, 642000ohm, 75V, 0.1% +/-Tol, Surface Mount, 0603; Manufacturer: KOA Speer; Power Rating: 100mW; Temperature Coefficient: 50ppm/°C; Supplier: DigiKey; Supplier Part Number: 2019-RN73H1JTTD6423B50CT-ND; Manufacturer Part Number: RN73H1JTTD6423B50; RoHS: Compliant; Category: Chip SMD Resistors; Stock: 6075; Pricing: 1=0,21, 10=0,18, 25=0,1668, 50=0,1576, 100=0,1488, 250=0,13828, 500=0,13108, 1000=0,12455 (USD); Case/Package: 0603; Case Code (Imperial): 0603; Case Code (Metric): 1608; Composition: Metal Film, Thin Film; Country of Origin: Japan; Export Control Classification Number (ECCN) Code: EAR99; Height: 450µm; Harmonized Tariff Schedule (HTS) Code: 8533.21.00.30; Introduction Date: 2013-02-03; Length: 1.6mm; Lifecycle Status: Production; Max Operating Temperature: 155°C; Min Operating Temperature: -55°C; Mounting Technology: Surface Mount; Number of Terminals: 2; Ratings: AEC-Q200; REACH SVHC: Yes; Termination: SMD/SMT; Tolerance: 0.1%; Voltage Rating: 75V; Width: 800µm; Working Voltage: 75V; ComponentLink1URL: https://datasheet.octopart.com:443/RN73H1JTTD6423B50-KOA-Speer-datasheet-182143700.pdf?src-supplier=IHS; ComponentLink1Description: https://datasheet.octopart.com:443/RN73H1JTTD6423B50-KOA-Speer-datasheet-182143700.pdf?src-supplier=IHS; ComponentLink2URL: https://datasheet.octopart.com:443/RN73H1JTTD6423B50-KOA-Speer-datasheet-149653818.pdf?src-supplier=element14+APAC; ComponentLink2Description: https://datasheet.octopart.com:443/RN73H1JTTD6423B50-KOA-Speer-datasheet-149653818.pdf?src-supplier=element14+APAC; ComponentLink3URL: http://sigma.octopart.com:80/rohs_statement/KOA-Speer-company-17.pdf?src-supplier=Compliance+Statements; ComponentLink3Description: http://sigma.octopart.com:80/rohs_statement/KOA-Speer-company-17.pdf?src-supplier=Compliance+Statements
R11 = Vishay CRCW0603100KFKEAHP: Res Thick Film 0603 100K Ohm 1% 1/3W ±100ppm/°C Molded SMD SMD Paper T/R; Manufacturer: Vishay; Max Power Dissipation: 250mW; Power Rating: 330mW; Voltage Rating: 75V; Supplier: RS; Supplier Part Number: 8206745P; Manufacturer Part Number: CRCW0603100KFKEAHP; RoHS: Compliant; Category: Chip SMD Resistors; Stock: 5725; Pricing: 25=0,036 (EUR); Case/Package: 0603; Case Code (Imperial): 0603; Case Code (Metric): 1608; China RoHS: Non-Compliant; Composition: Thick Film; Contact Plating: Tin; Country of Origin: Israel; Depth: 850µm; Export Control Classification Number (ECCN) Code: EAR99; Features: Automotive AEC-Q200; Height: 450µm; Harmonized Tariff Schedule (HTS) Code: 8533.21.00.30; Introduction Date: 2008-07-29; Lead Free: Lead Free; Length: 1.6mm; Lifecycle Status: Production; Max Operating Temperature: 155°C; Military Standard: Not; Min Operating Temperature: -55°C; Mounting Technology: Surface Mount; Pins: 2; Number of Terminals: 2; Number of Terminations: 2; Packaging: Cut Tape; Radiation Hardening: No; Ratings: AEC-Q200; REACH SVHC: Yes; Schedule B: 8533210045, 8533210045|8533210045|8533210045|8533210045|8533210045; Temperature Coefficient: 100ppm/°C; Termination: SMD/SMT; Tolerance: 1%; Voltage Rating (DC): 75V; Weight: 2.012816mg; Width: 850µm; Working Voltage: 75V; ComponentLink1URL: https://datasheet.octopart.com:443/CRCW0603100KFKEAHP-Vishay-datasheet-13148866.pdf?src-supplier=Future+Electronics; ComponentLink1Description: https://datasheet.octopart.com:443/CRCW0603100KFKEAHP-Vishay-datasheet-13148866.pdf?src-supplier=Future+Electronics; ComponentLink2URL: https://datasheet.octopart.com:443/CRCW0603100KFKEAHP-Vishay-datasheet-13131392.pdf?src-supplier=Future+Electronics; ComponentLink2Description: https://datasheet.octopart.com:443/CRCW0603100KFKEAHP-Vishay-datasheet-13131392.pdf?src-supplier=Future+Electronics; ComponentLink3URL: https://datasheet.octopart.com:443/CRCW0603100KFKEAHP-Vishay-datasheet-12593106.pdf?src-supplier=Future+Electronics; ComponentLink3Description: https://datasheet.octopart.com:443/CRCW0603100KFKEAHP-Vishay-datasheet-12593106.pdf?src-supplier=Future+Electronics; ComponentLink4URL: https://datasheet.octopart.com:443/CRCW0603100KFKEAHP-Vishay-datasheet-12531795.pdf?src-supplier=Future+Electronics; ComponentLink4Description: https://datasheet.octopart.com:443/CRCW0603100KFKEAHP-Vishay-datasheet-12531795.pdf?src-supplier=Future+Electronics; ComponentLink5URL: https://datasheet.octopart.com:443/CRCW0603100KFKEAHP-Vishay-datasheet-12518686.pdf?src-supplier=Future+Electronics; ComponentLink5Description: https://datasheet.octopart.com:443/CRCW0603100KFKEAHP-Vishay-datasheet-12518686.pdf?src-supplier=Future+Electronics; ComponentLink6URL: https://datasheet.octopart.com:443/CRCW0603100KFKEAHP-Vishay-datasheet-12509906.pdf?src-supplier=Future+Electronics; ComponentLink6Description: https://datasheet.octopart.com:443/CRCW0603100KFKEAHP-Vishay-datasheet-12509906.pdf?src-supplier=Future+Electronics; ComponentLink7URL: https://datasheet.octopart.com:443/CRCW0603100KFKEAHP-Vishay-datasheet-10669844.pdf?src-supplier=Future+Electronics; ComponentLink7Description: https://datasheet.octopart.com:443/CRCW0603100KFKEAHP-Vishay-datasheet-10669844.pdf?src-supplier=Future+Electronics; ComponentLink8URL: https://datasheet.octopart.com:443/CRCW0603100KFKEAHP-Vishay-datasheet-8703221.pdf?src-supplier=Future+Electronics; ComponentLink8Description: https://datasheet.octopart.com:443/CRCW0603100KFKEAHP-Vishay-datasheet-8703221.pdf?src-supplier=Future+Electronics; ComponentLink9URL: https://datasheet.octopart.com:443/CRCW0603100KFKEAHP-Vishay-datasheet-62316122.pdf?src-supplier=Future+Electronics; ComponentLink9Description: https://datasheet.octopart.com:443/CRCW0603100KFKEAHP-Vishay-datasheet-62316122.pdf?src-supplier=Future+Electronics; ComponentLink10URL: https://datasheet.octopart.com:443/CRCW0603100KFKEAHP-Vishay-datasheet-12544674.pdf?src-supplier=_legacy+Avnet; ComponentLink10Description: https://datasheet.octopart.com:443/CRCW0603100KFKEAHP-Vishay-datasheet-12544674.pdf?src-supplier=_legacy+Avnet; ComponentLink11URL: https://datasheet.octopart.com:443/CRCW0603100KFKEAHP-Vishay-datasheet-87136057.pdf?src-supplier=Newark; ComponentLink11Description: https://datasheet.octopart.com:443/CRCW0603100KFKEAHP-Vishay-datasheet-87136057.pdf?src-supplier=Newark; ComponentLink12URL: https://datasheet.octopart.com:443/CRCW0603100KFKEAHP-Vishay-datasheet-66581887.pdf?src-supplier=Newark; ComponentLink12Description: https://datasheet.octopart.com:443/CRCW0603100KFKEAHP-Vishay-datasheet-66581887.pdf?src-supplier=Newark; ComponentLink13URL: https://datasheet.octopart.com:443/CRCW0603100KFKEAHP-Vishay-datasheet-37143532.pdf?src-supplier=Newark; ComponentLink13Description: https://datasheet.octopart.com:443/CRCW0603100KFKEAHP-Vishay-datasheet-37143532.pdf?src-supplier=Newark; ComponentLink14URL: https://datasheet.octopart.com:443/CRCW0603100KFKEAHP-Vishay-datasheet-8359436.pdf?src-supplier=Newark; ComponentLink14Description: https://datasheet.octopart.com:443/CRCW0603100KFKEAHP-Vishay-datasheet-8359436.pdf?src-supplier=Newark; ComponentLink15URL: https://datasheet.octopart.com:443/CRCW0603100KFKEAHP-Vishay-datasheet-112276998.pdf?src-supplier=Newark; ComponentLink15Description: https://datasheet.octopart.com:443/CRCW0603100KFKEAHP-Vishay-datasheet-112276998.pdf?src-supplier=Newark; ComponentLink16URL: https://datasheet.octopart.com:443/CRCW0603100KFKEAHP-Vishay-datasheet-62317933.pdf?src-supplier=element14+APAC; ComponentLink16Description: https://datasheet.octopart.com:443/CRCW0603100KFKEAHP-Vishay-datasheet-62317933.pdf?src-supplier=element14+APAC; ComponentLink17URL: https://datasheet.octopart.com/CRCW0603100KFKEAHP-Vishay-datasheet-83567917.pdf; ComponentLink17Description: https://datasheet.octopart.com/CRCW0603100KFKEAHP-Vishay-datasheet-83567917.pdf; ComponentLink18URL: https://datasheet.octopart.com:443/CRCW0603100KFKEAHP-Vishay-Dale-datasheet-47688881.pdf?src-supplier=RS+(Formerly+Allied+Electronics); ComponentLink18Description: https://datasheet.octopart.com:443/CRCW0603100KFKEAHP-Vishay-Dale-datasheet-47688881.pdf?src-supplier=RS+(Formerly+Allied+Electronics); ComponentLink19URL: http://sigma.octopart.com:80/rohs_statement/Vishay-company-15.pdf?src-supplier=Compliance+Statements; ComponentLink19Description: http://sigma.octopart.com:80/rohs_statement/Vishay-company-15.pdf?src-supplier=Compliance+Statements